# EAGLE design POWER_reset (EAGLE 9.5.2)
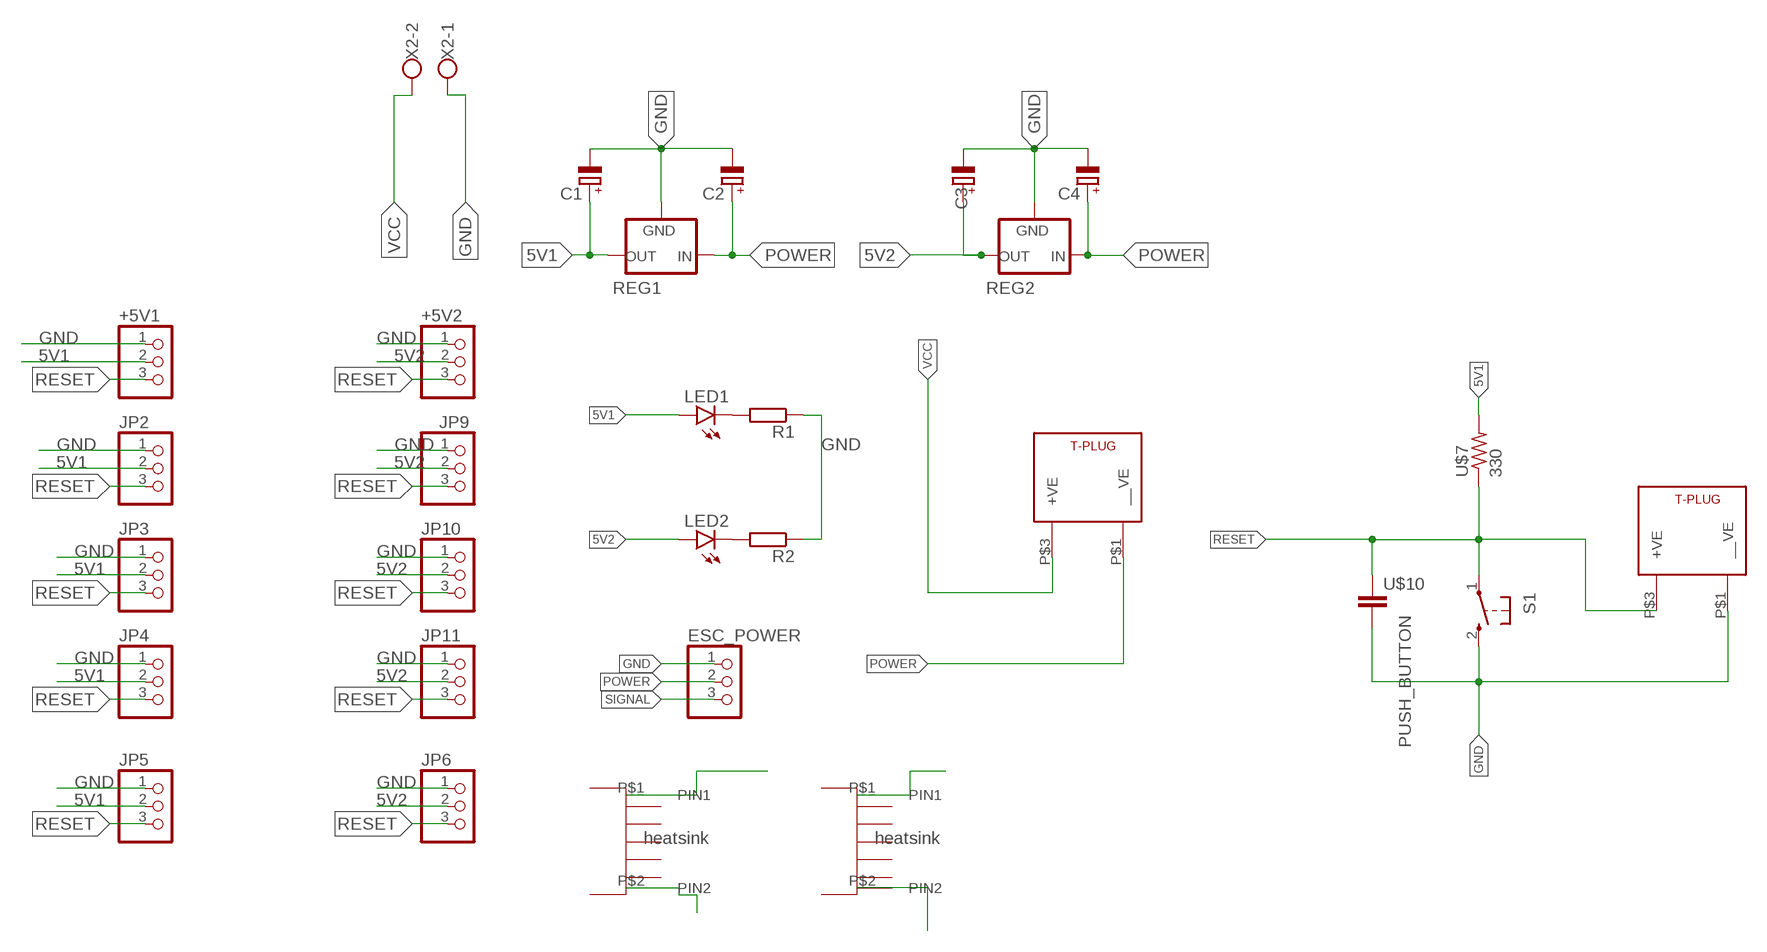
[diagram p0: schematic, sheet 1]

## Parts
+5V1  PINHD-3_DATA  [1X03_DATA]
+5V2  PINHD-3_DATA  [1X03_DATA]
C1  CAP_POL  [E3,5-8]
C2  CAP_POL  [E3,5-8]
C3  CAP_POL  [E3,5-8]
C4  CAP_POL  [E3,5-8]
ESC_POWER  PINHD-3_DATA  [1X03_DATA]
JP2  PINHD-3_DATA  [1X03_DATA]
JP3  PINHD-3_DATA  [1X03_DATA]
JP4  PINHD-3_DATA  [1X03_DATA]
JP5  PINHD-3_DATA  [1X03_DATA]
JP6  PINHD-3_DATA  [1X03_DATA]
JP9  PINHD-3_DATA  [1X03_DATA]
JP10  PINHD-3_DATA  [1X03_DATA]
JP11  PINHD-3_DATA  [1X03_DATA]
LED1  LED5MM  [LED5MM]
LED2  LED5MM  [LED5MM]
R1  R-EU_0204/7  [0204/7]
R2  R-EU_0204/7  [0204/7]
REG1  78XXS  [78XXS]
REG2  78XXS  [78XXS]
S1  PUSH_BUTTON  [B3F-10XX]
U$1  HEAT-SINK  [HEAT_SINK]
U$2  HEAT-SINK  [HEAT_SINK]
U$3  T_CONNECTOR  [T-PLUG]
U$4  T_CONNECTOR  [T-PLUG]
U$7  330  RES-7  [0204/7]
U$10  CAPACITOR  [C025-025X050]
X2  ROSTA.POWER  [W239-302]

## Nets
5V1: +5V1.2 C1.+ JP2.2 JP3.2 JP4.2 JP5.2 LED1.A REG1.OUT U$7.2
5V2: +5V2.2 C3.+ JP6.2 JP9.2 JP10.2 JP11.2 LED2.A REG2.OUT
GND: +5V1.1 +5V2.1 C1.- C2.- C3.- C4.- ESC_POWER.1 JP2.1 JP3.1 JP4.1 JP5.1 JP6.1 JP9.1 JP10.1 JP11.1 R1.1 R2.1 REG1.GND REG2.GND S1.2(S) U$3.P$1(__VE) U$10.2 X2.1
N$1: LED1.K(C) R1.2
N$2: LED2.K(C) R2.2
N$3: U$1.P$2(PIN2)
N$4: U$1.P$1(PIN1)
N$5: U$2.P$1(PIN1)
N$6: U$2.P$2(PIN2)
POWER: C2.+ C4.+ ESC_POWER.2 REG1.IN REG2.IN U$4.P$1(__VE)
RESET: +5V1.3 +5V2.3 JP2.3 JP3.3 JP4.3 JP5.3 JP6.3 JP9.3 JP10.3 JP11.3 S1.1(P) U$3.P$3(+VE) U$7.1 U$10.1
SIGNAL: ESC_POWER.3
VCC: U$4.P$3(+VE) X2.2

## Library data of the parts
+5V1 +5V2 ESC_POWER JP2-JP6 JP9-JP11 = MIA_LIBRARY-2-2-2:PINHD-3_DATA: PIN HEADER
C1-C4 = MIA_LIBRARY-2-2-2:CAP_POL
LED1 LED2 = led:LED: LED OSRAM: - CHIPLED LG R971, LG N971, LY N971, LG Q971, LY Q971, LO R971, LY R971 LH N974, LH R974 LS Q976, LO Q976, LY Q976 LO Q996 - Hyper CHIPLED LW Q18S LB Q993, LB Q99A, LB R99A - SideLED LS A670, LO A670, LY A670, LG A670, LP A670 LB A673, LV A673, LT A673, LW A673 LH A674 LY A675 LS A676, LA A676, LO A676, LY A676, LW A676 LS A679, LY A679, LG A679 - Hyper Micro SIDELED® LS Y876, LA Y876, LO Y876, LY Y876 LT Y87S - SmartLED LW L88C, LW L88S LB L89C, LB L89S, LG L890 LS L89K, LO L89K, LY L89K LS L896, LA L896, LO L896, LY L896 - TOPLED LS T670, LO T670, LY T670, LG T670, LP T670 LSG T670, LSP T670, LSY T670, LOP T670, LYG T670 LG T671, LOG T671, LSG T671 LB T673, LV T673, LT T673, LW T673 LH T674 LS T676, LA T676, LO T676, LY T676, LB T676, LH T676, LSB T676, LW T676 LB T67C, LV T67C, LT T67C, LS T67K, LO T67K, LY T67K, LW E67C LS E67B, LA E67B, LO E67B, LY E67B, LB E67C, LV E67C, LT E67C LW T67C LS T679, LY T679, LG T679 LS T770, LO T770, LY T770, LG T770, LP T770 LB T773, LV T773, LT T773, LW T773 LH T774 LS E675, LA E675, LY E675, LS T675 LS T776, LA T776, LO T776, LY T776, LB T776 LHGB T686 LT T68C, LB T68C - Hyper Mini TOPLED® LB M676 - Mini TOPLED Santana® LG M470 LS M47K, LO M47K, LY M47K Source: http://www.osram.convergy.de LUXEON: - LUMILED® LXK2-PW12-R00, LXK2-PW12-S00, LXK2-PW14-U00, LXK2-PW14-V00 LXK2-PM12-R00, LXK2-PM12-S00, LXK2-PM14-U00 LXK2-PE12-Q00, LXK2-PE12-R00, LXK2-PE12-S00, LXK2-PE14-T00, LXK2-PE14-U00 LXK2-PB12-K00, LXK2-PB12-L00, LXK2-PB12-M00, LXK2-PB14-N00, LXK2-PB14-P00, LXK2-PB14-Q00 LXK2-PR12-L00, LXK2-PR12-M00, LXK2-PR14-Q00, LXK2-PR14-R00 LXK2-PD12-Q00, LXK2-PD12-R00, LXK2-PD12-S00 LXK2-PH12-R00, LXK2-PH12-S00 LXK2-PL12-P00, LXK2-PL12-Q00, LXK2-PL12-R00 Source: www.luxeon.com KINGBRIGHT: KA-3528ASYC Source: www.kingbright.com
R1 R2 = rcl:R-EU_: RESISTOR, European symbol; SPICEPREFIX: R
REG1 REG2 = MIA_LIBRARY-2-2-2:78XXS: VOLTAGE REGULATOR
S1 = MIA_LIBRARY-2-2-2:PUSH_BUTTON: OMRON SWITCH
U$1 U$2 = MIA_LIBRARY-2-2-2:HEAT-SINK
U$3 U$4 = MIA_LIBRARY-2-2-2:T_CONNECTOR
U$7 = MIA_LIBRARY-2-2-2:RES-7
U$10 = MIA_LIBRARY-2-2-2:CAPACITOR
X2 = MIA_LIBRARY-2-2-2:ROSTA.POWER: WAGO SCREW CLAMP; OC_FARNELL: unknown; OC_NEWARK: unknown

## Board
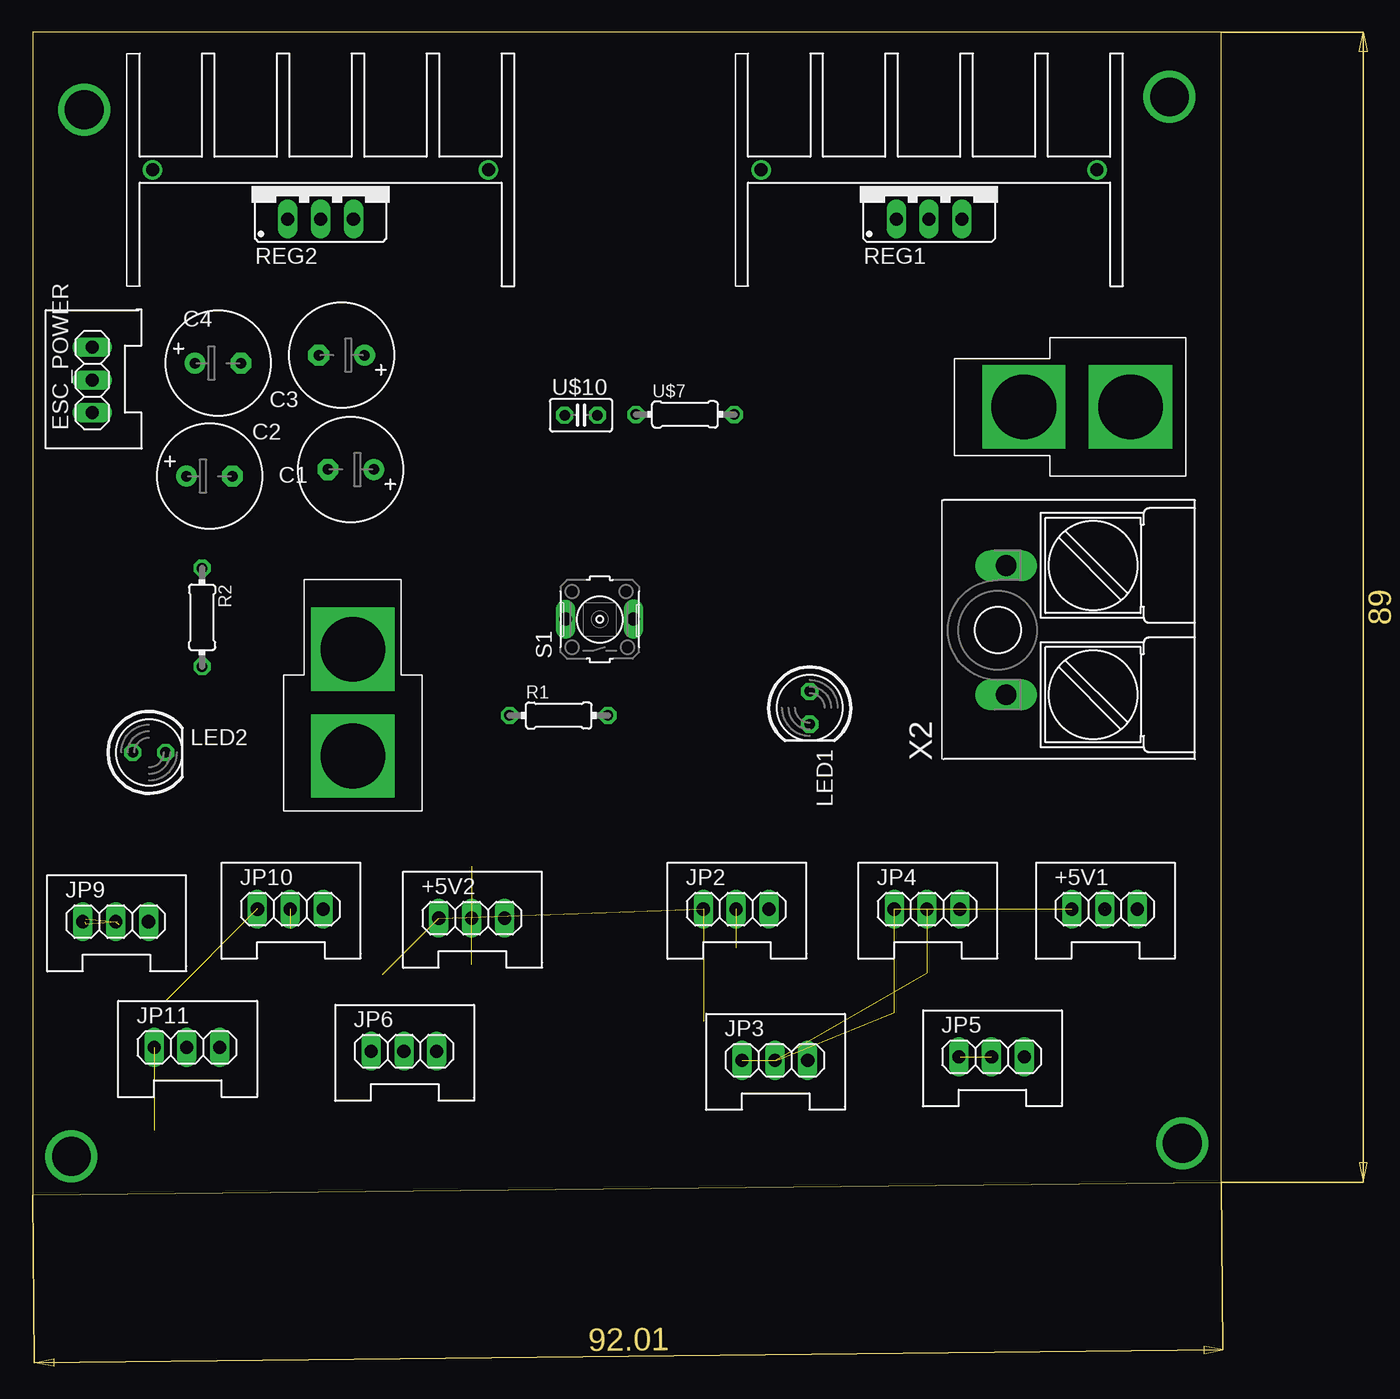
[diagram p1: board, top side]
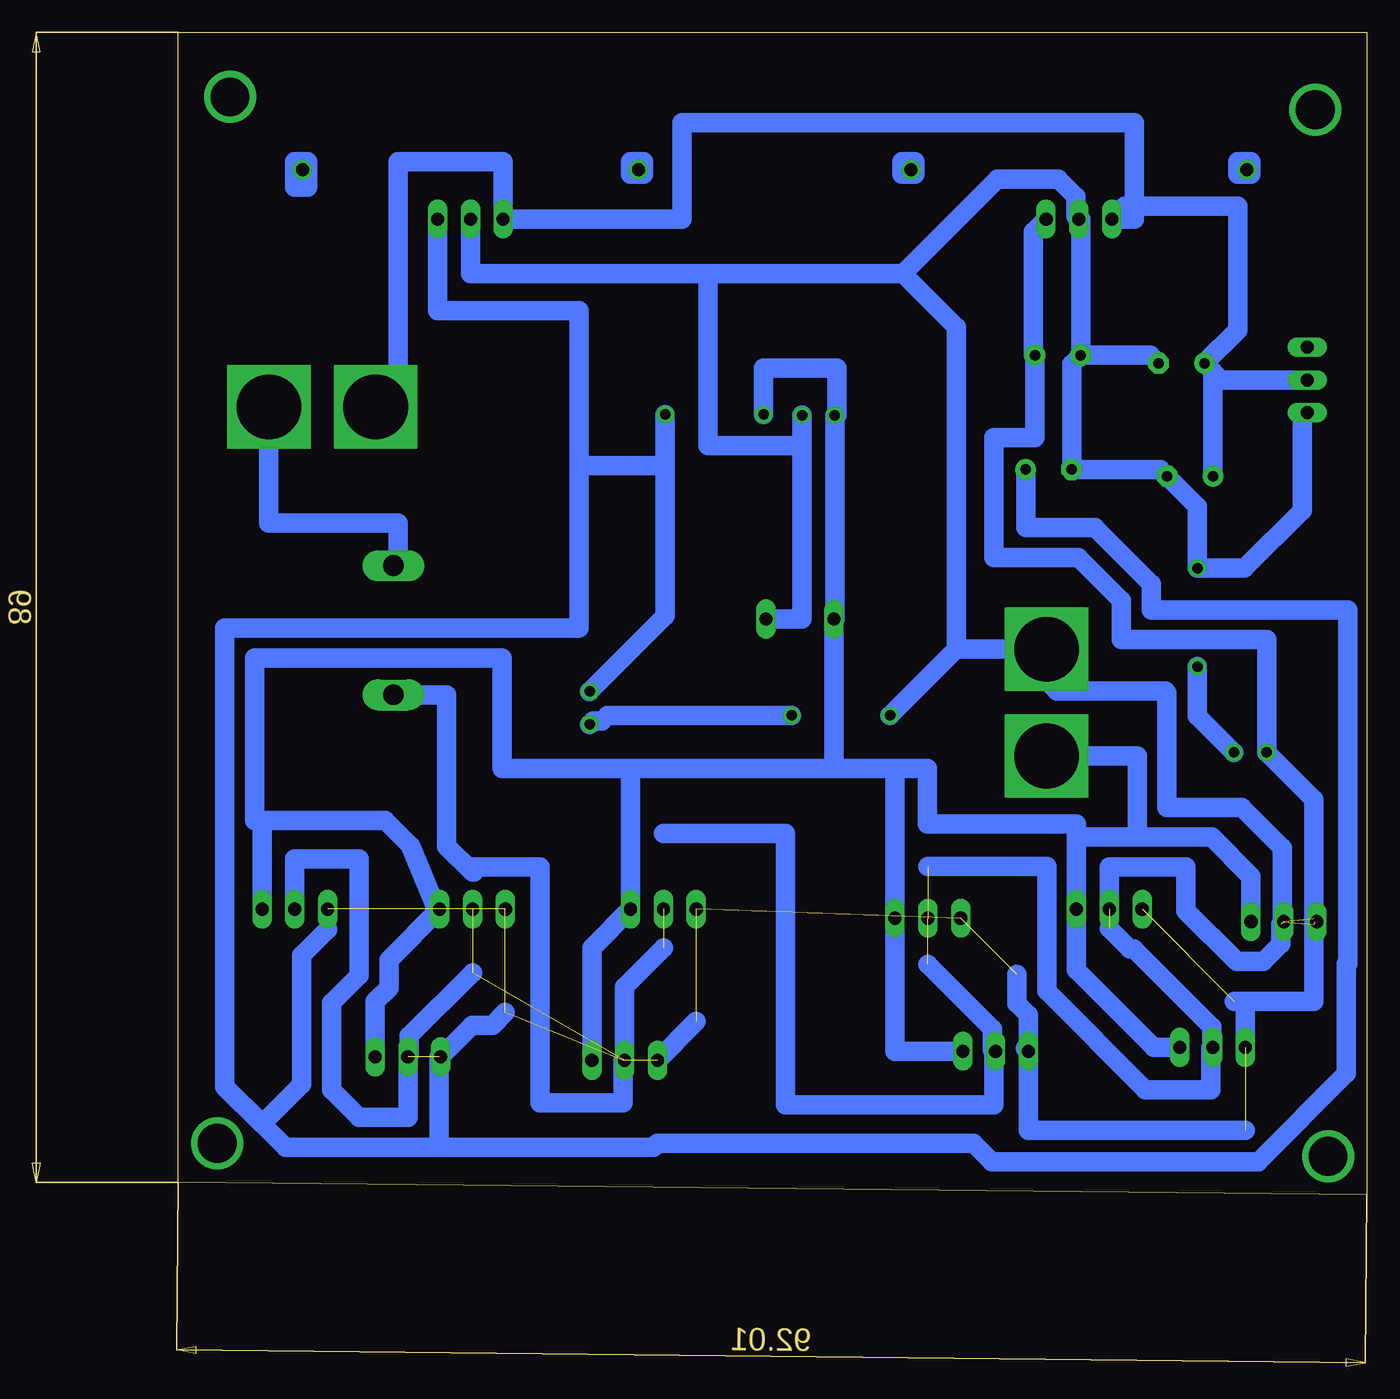
[diagram p2: board, bottom side, seen from below]

Size 92 x 90 mm. Coordinates in mm from the lower left corner, seen from the top.
Outline: 0,0 92,1 92,90 0,90 0,0
Copper layers (1*16): Top 0.035mm / dielectric 1.5mm / Bottom 0.035mm
Design rules "default *": minimum track width 1.5mm, minimum drill 0.35mm, track to track 0.8mm, track to pad 0.8mm, pad to pad 6mil, via to via 6mil, smd to smd 6mil, copper to edge 0.5mm, drill to drill 6mil, minimum pad ring 10mil, minimum via ring 8mil, stop-mask expansion 4mil, vias tented up to drill 0mil, thermal gap 10mil

### Footprints (pad centres in the part's own frame; a part is rotated, then mirrored left to right if it is on the bottom)
1X03_DATA = drill 1.016 long: 1 -2.54,0; 2 0,0; 3 2.54,0
E3,5-8 = drill 0.813 pad 1.6: + -1.778,0 | drill 0.813 pad 1.6 octagon: - 1.778,0
LED5MM = drill 0.813 octagon: A -1.27,0; K 1.27,0
0204/7 = drill 0.813 octagon: 1 -3.81,0; 2 3.81,0
78XXS = drill 1.016 long: GND 0,-2.54; IN -2.54,-2.54; OUT 2.54,-2.54
B3F-10XX = drill 1.016 long: 1 0.013,2.636; 2 0.029,-2.605
HEAT_SINK = drill 1: P$1 0,13; P$2 0,-13
T-PLUG = drill 5 pad 6.452 square: P$1 -2.73,-4; P$3 -11,-4
C025-025X050 = drill 0.813 octagon: 1 -1.27,0; 2 1.27,0
W239-302 = drill 1.6 long: 1 -5,5; 2 5,5

### Placement (x,y rotation side)
+5V1  82.98,22.13 0 top
+5V2  33.98,21.43 0 top
C1  24.63,56.16 180 top
C2  13.69,55.65 0 top
C3  23.92,65.01 180 top
C4  14.35,64.39 0 top
ESC_POWER  4.62,63.09 90 top
JP2  54.45,22.13 0 top
JP3  57.45,10.43 0 top
JP4  69.23,22.13 0 top
JP5  74.23,10.7 0 top
JP6  28.74,11.13 0 top
JP9  6.43,21.16 0 top
JP10  19.94,22.13 0 top
JP11  11.94,11.43 0 top
LED1  60.15,37.71 270 top
LED2  9.02,34.26 0 top
R1  40.72,37.12 0 top
R2  13.12,44.71 270 top
REG1  69.39,78.09 0 top
REG2  22.29,78.09 0 top
S1  43.9,44.56 90 top
U$1  22.29,79.36 90 top
U$2  69.39,79.36 90 top
U$3  20.78,44.99 90 top
U$4  74,57 180 top
U$7  50.5,60.42 0 top
U$10  42.45,60.37 0 top
X2  80.36,43.72 90 top

### Tracks (layer width: path | path; a pad name or v marks a point on that pad's centre or on a via)
5V1  (5 unrouted)
  Bottom 1.5: REG1.OUT 71.93,68.46 61,68.46 61,56.46 | U$7.2 54.31,56.46 | 54.31,56.46 61,56.46 | 61,56.46 61,43.87 88.39,43.87 88.39,8.39 85.5,5.5 | 71.82,10.7 71.82,3.7 | LED1.A 54.31,44.82 54.31,56.46 | C1.+ 26.41,51.65 21.05,51.65 16.7,47.3 16.7,45.3 1.48,45.3 1.48,17.88 1.58,17.88 1.58,9.42 8.42,2.58 29.03,2.58 30.45,4 54.91,4 55.21,3.7 71.82,3.7 | 71.82,3.7 83.7,3.7 85.5,5.5 | 80.44,20.56 82.44,18.56 82.44,8.56 85.5,5.5 | 54.45,19.13 57.45,16.13 JP3.2 | 83,22.13 83,26 78,26 78,17 80.14,14.86 80.14,8.14 78,6 74.23,6 JP5.2 74.12,10.81 74.12,12.3 69.23,17.19
5V2  (5 unrouted)
  Bottom 1.5: REG2.OUT 25.83,74.55 25.83,65.01 C3.+ 25.7,58.61 28.86,58.61 28.86,49.35 22.35,49.35 19,46 19,43 7.75,43 LED2.A 4.12,30.63 4.12,21.39 | JP10.2 19.94,25.41 14,25.41 14,22 10.09,18.09 8.01,18.09 6.66,19.44 6.66,20.93 | JP11.2 12.07,11.43 | 12.07,11.43 12.07,8.15 17.15,8.15 24.79,15.79 24.79,25.43 33.98,25.43 | 19.94,20.64 18.36,19.06 18.06,19.06 12,13 12,11.5 12.07,11.43 | 28.87,11.13 JP6.2 | 28.87,11.13 28.87,7 45,7 45,28 54.45,28 | 28.87,11.13 28.97,11.23 28.97,12.85 33.98,17.86
GND  (11 unrouted)
  Bottom 1.5: X2.1 71.23,38.72 71.23,27 69.23,25 69.1,25 69.1,25.41 64,25.41 64,7.15 57.58,7.15 57.58,10.43 | REG1.GND 69.39,71.32 51,71.32 | 51,71.32 35.91,71.32 | U$10.2 43.72,58 | 43.72,58 43.72,44.59 S1.2 | 43.72,58 51,58 51,71.32 | C4.- 16.75,65.01 C3.- | ESC_POWER.1 5,60.17 5,53 9.48,48.52 R2.1 13.12,53.3 C2.- 15.98,56.16 C1.- 22.85,64.3 C3.- | 6.56,21.16 6.56,26.86 9.7,30.01 15.48,30.01 15.48,38.87 15.61,39 24,39 24.78,39.78 U$3.P$1 31.77,42.26 | 31.77,42.26 R1.1 | C3.- 22.14,75.53 22.16,75.55 REG2.GND 22.52,75.78 22.52,77.27 23.87,78.62 28.6,78.62 35.91,71.32 | 35.91,71.32 31.77,67.18 31.77,42.26 | 51.91,13.43 JP3.1 | 66.69,14.13 67.69,13.13 69.26,13.13 JP5.1 | JP9.1 4.02,21.16 | 10.27,15 9.4,15 | 9.4,15 4.12,15 4.12,20.93 | JP11.1 9.4,15 | JP6.1 26.44,11.37 | JP6.1 26.2,5 9.4,5 | 27.09,17.08 27.09,14.83 26.2,13.95 JP6.1
N$1
  Bottom 1.5: R1.2 58.76,37.12 59.2,36.68 59.91,36.68 LED1.K
N$2
  Bottom 1.5: R2.2 13.12,37.09 LED2.K
N$3
  Bottom 1.5: U$1.P$2 35.29,80 36,80 36,79.36 | 35.29,79 35,79 35,79.36 | U$1.P$2 35,79.36 | 35,79.36 35,80 | U$1.P$2 36,79.36 | 36,79.36 36,79 35.29,79 | 35.29,79 U$1.P$2
N$4
  Bottom 1.5: 9.29,80 9,80 9,79.36 | 9,79.36 U$1.P$1 | 9.29,79 10,79 | 9.29,80 10,80 10,79.36 U$1.P$1 | 9.29,80 U$1.P$1 | U$1.P$1 9.29,79 | 9.29,79 9,79 9,79.36
N$5
  Bottom 1.5: 57,79.36 57,80 56,80 56,79 57,79 57,79.36 | U$2.P$1 57,79.36
N$6
  Bottom 1.5: U$2.P$2 83,79.36 83,80 82,80 82,78 83,78 83,79 82.39,79 U$2.P$2
N$7  (via drill 3)
  other vias: 3,3
N$8  (via drill 3)
  other vias: 89,4
N$9  (via drill 3)
  other vias: 88,85
N$10  (via drill 3)
  other vias: 4,84
POWER
  Bottom 1.5: U$4.P$1 75,61 75,80 66.85,80 REG1.IN 53,75.55 53,83 18,83 18,75.55 REG2.IN 18.75,76.55 10,76.55 10,66.96 C4.+ | C4.+ 11.27,63.09 ESC_POWER.2 | C2.+ 11.91,63.73 C4.+
RESET
  Bottom 1.5: JP3.3 59.99,19.13 JP2.3 57,33 | +5V2.3 36.52,11.13 JP6.3 | JP11.3 16.48,11.43 22.48,17.43 JP10.3 22.48,27.71 | 85.52,29 76,29 74.03,27.03 72,22.13 JP4.3 75.7,18.2 75.7,16.05 76.77,14.98 JP5.3 | 22.48,27.71 22.48,28.71 34,28.71 34,33 36.52,33 | 17.78,27.71 12,27.71 8.97,24.68 JP9.3 | 17.78,27.71 22.48,27.71 | 17.78,27.71 17.78,33.99 U$3.P$3 | U$7.1 46.69,64 41,64 41,60.37 U$10.1 41.18,44.57 S1.1 41.26,33.26 41,33 | 57,33 66.93,33 66.93,41.57 86.09,41.57 86.09,29 85.52,29 | 57,33 41,33 | 41,33 36.52,33 | +5V2.3 36.52,21.7 | +5V1.3 85.52,29 | +5V2.3 36.52,33
VCC
  Bottom 1.5: U$4.P$3 85,52 75,52 75,48.72 X2.2